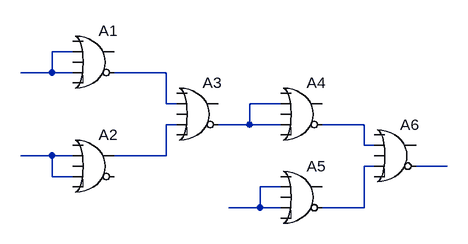
[diagram p0: schematic testFunc2.asc]
testFunc2.asc, the LTspice schematic file:
Version 4
SHEET 1 1924 980
WIRE 32 -752 0 -752
WIRE 0 -720 0 -752
WIRE 0 -720 -48 -720
WIRE 32 -720 0 -720
WIRE 176 -720 96 -720
WIRE 176 -672 176 -720
WIRE 192 -672 176 -672
WIRE 352 -672 304 -672
WIRE 192 -640 176 -640
WIRE 304 -640 304 -672
WIRE 304 -640 256 -640
WIRE 352 -640 304 -640
WIRE 480 -640 416 -640
WIRE 480 -608 480 -640
WIRE 496 -608 480 -608
WIRE 0 -592 -48 -592
WIRE 32 -592 0 -592
WIRE 176 -592 176 -640
WIRE 176 -592 96 -592
WIRE 496 -576 480 -576
WIRE 608 -576 560 -576
WIRE 0 -560 0 -592
WIRE 32 -560 0 -560
WIRE 352 -544 320 -544
WIRE 320 -512 320 -544
WIRE 320 -512 272 -512
WIRE 352 -512 320 -512
WIRE 480 -512 480 -576
WIRE 480 -512 416 -512
SYMBOL Digital\\or 64 -800 R0
SYMATTR InstName A1
SYMBOL Digital\\or 64 -640 R0
SYMATTR InstName A2
SYMBOL Digital\\or 224 -720 R0
SYMATTR InstName A3
SYMBOL Digital\\or 384 -720 R0
SYMATTR InstName A4
SYMBOL Digital\\or 384 -592 R0
SYMATTR InstName A5
SYMBOL Digital\\or 528 -656 R0
SYMATTR InstName A6

The netlist it stands for:
* testFunc2.asc
A1 0 N001 0 N001 0 N002 0 0 OR
A2 0 N006 0 N006 0 0 N004 0 OR
A3 0 N002 0 N004 0 N003 0 0 OR
A4 0 N003 0 N003 0 N005 0 0 OR
A5 0 N009 0 N009 0 N007 0 0 OR
A6 0 N005 0 N007 0 N008 0 0 OR
.backanno
.end